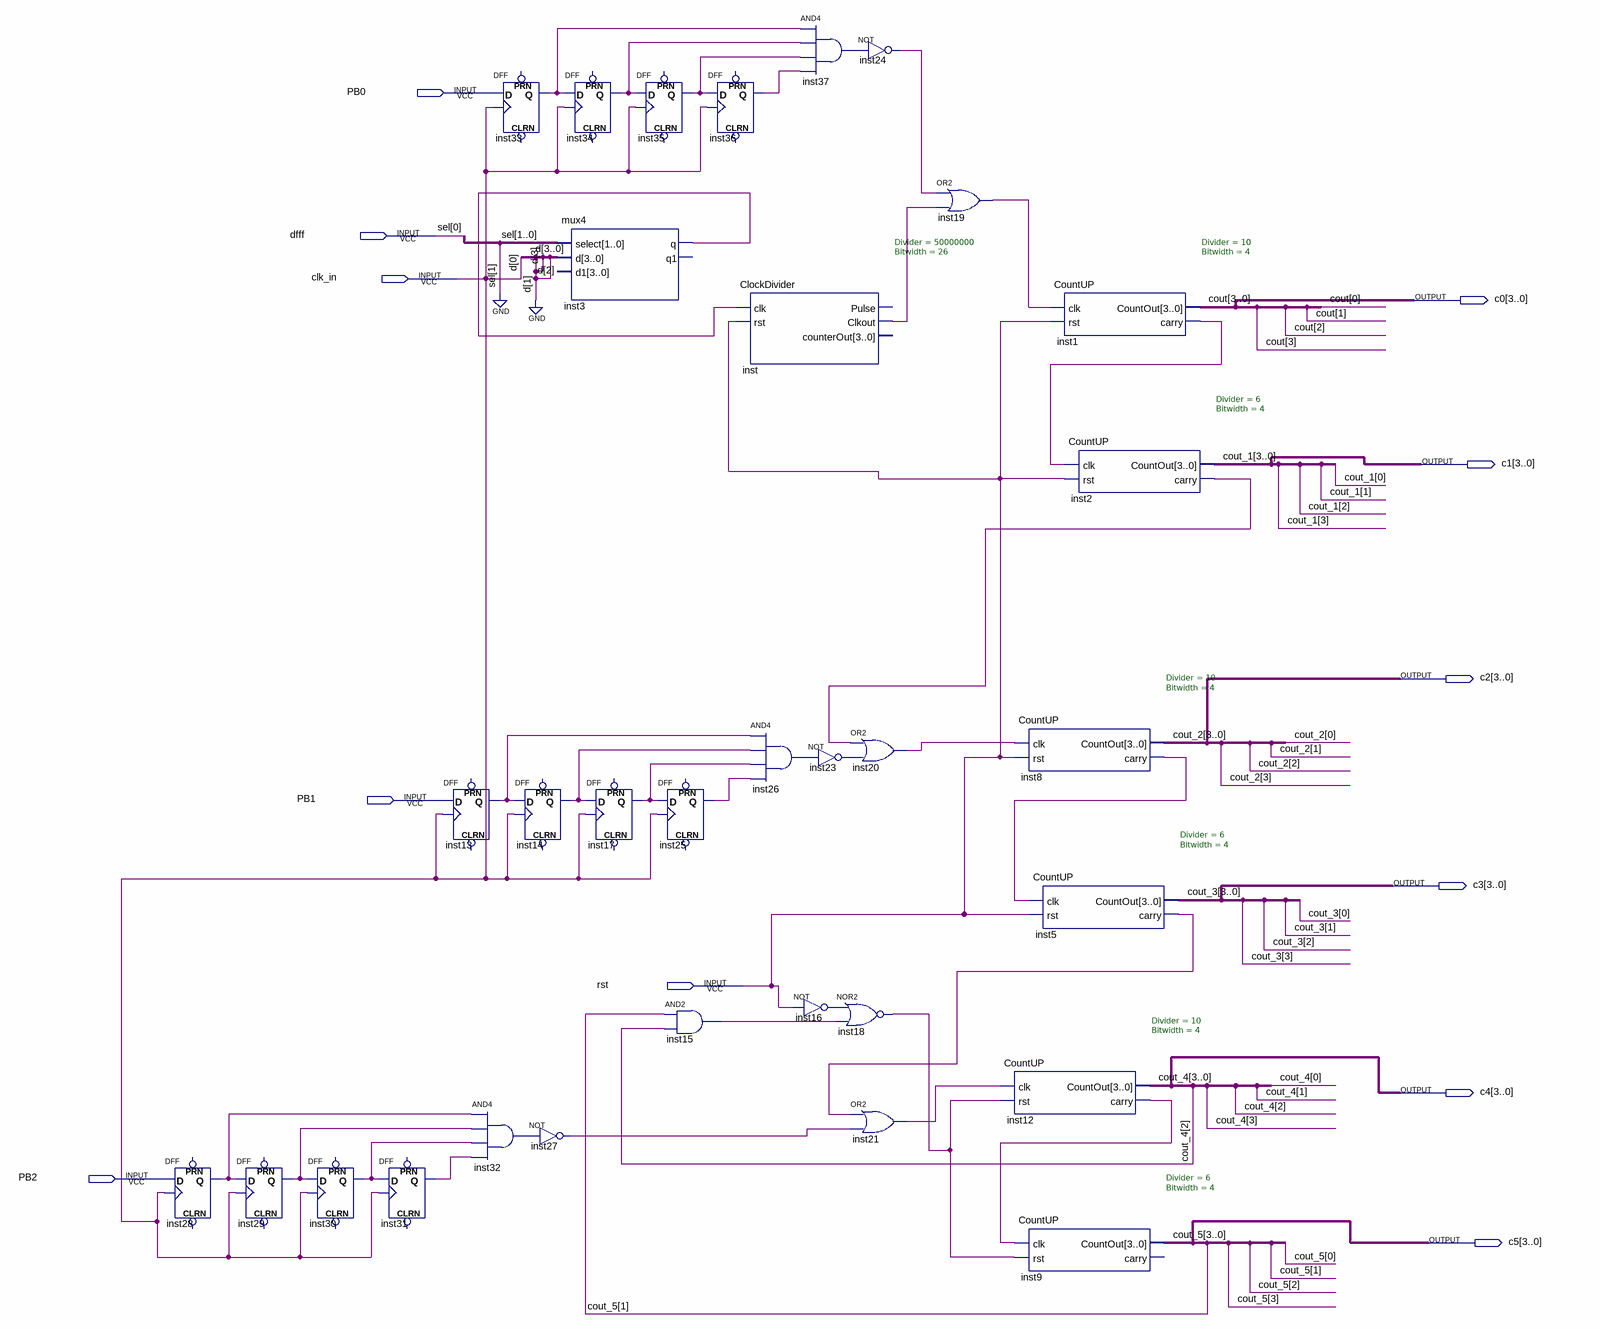
[diagram p0: schematic sheet]
// Quartus schematic ggggk.bdf as structural Verilog: 32 symbols, 12 pins
module ggggk (
  input  PB0,
  input  dfff,
  input  clk_in,
  input  PB1,
  input  rst,
  input  PB2,
  output [3:0] c0,
  output [3:0] c1,
  output [3:0] c2,
  output [3:0] c3,
  output [3:0] c4,
  output [3:0] c5
);

  wire inst1_carry, inst2_carry, inst3_q, inst5_carry, inst8_carry, inst12_carry, inst13_q, inst14_q,
       inst15_out, inst16_out, inst17_q, inst18_out, inst19_out, inst20_out, inst21_out, inst23_out,
       inst24_out, inst25_q, inst26_out, inst27_out, inst28_q, inst29_q, inst30_q, inst31_q, inst32_out,
       inst33_q, inst34_q, inst35_q, inst36_q, inst37_out, inst_clkout;

  DFF inst28 (.CLK(clk_in), .D(PB2), .Q(inst28_q));  // open: CLRN, PRN
  DFF inst29 (.CLK(clk_in), .D(inst28_q), .Q(inst29_q));  // open: CLRN, PRN
  DFF inst30 (.CLK(clk_in), .D(inst29_q), .Q(inst30_q));  // open: CLRN, PRN
  DFF inst31 (.CLK(clk_in), .D(inst30_q), .Q(inst31_q));  // open: CLRN, PRN
  DFF inst13 (.CLK(clk_in), .D(PB1), .Q(inst13_q));  // open: CLRN, PRN
  DFF inst33 (.CLK(clk_in), .D(PB0), .Q(inst33_q));  // open: CLRN, PRN
  DFF inst14 (.CLK(clk_in), .D(inst13_q), .Q(inst14_q));  // open: CLRN, PRN
  and inst32 (inst32_out, inst28_q, inst29_q, inst30_q, inst31_q);
  DFF inst34 (.CLK(clk_in), .D(inst33_q), .Q(inst34_q));  // open: CLRN, PRN
  mux4 inst3 (.select({1'b0, dfff}), .d({3'b000, clk_in}), .q(inst3_q));  // open: d1, q1
  not inst27 (inst27_out, inst32_out);
  DFF inst17 (.CLK(clk_in), .D(inst14_q), .Q(inst17_q));  // open: CLRN, PRN
  DFF inst35 (.CLK(clk_in), .D(inst34_q), .Q(inst35_q));  // open: CLRN, PRN
  DFF inst25 (.CLK(clk_in), .D(inst17_q), .Q(inst25_q));  // open: CLRN, PRN
  and inst15 (inst15_out, c5[1], c4[2]);
  DFF inst36 (.CLK(clk_in), .D(inst35_q), .Q(inst36_q));  // open: CLRN, PRN
  ClockDivider #(.Divider(50000000), .Bitwidth(26)) inst (
    .clk(inst3_q), .rst(rst), .Clkout(inst_clkout));  // open: Pulse, counterOut
  and inst37 (inst37_out, inst33_q, inst34_q, inst35_q, inst36_q);
  and inst26 (inst26_out, inst13_q, inst14_q, inst17_q, inst25_q);
  not inst16 (inst16_out, rst);
  not inst24 (inst24_out, inst37_out);
  or inst20 (inst20_out, inst2_carry, inst23_out);
  not inst23 (inst23_out, inst26_out);
  nor inst18 (inst18_out, inst16_out, inst15_out);
  or inst21 (inst21_out, inst5_carry, inst27_out);
  or inst19 (inst19_out, inst24_out, inst_clkout);
  CountUP #(.Divider(10), .Bitwidth(4)) inst8 (.clk(inst20_out), .rst(rst), .CountOut(c2), .carry(inst8_carry));
  CountUP #(.Divider(6), .Bitwidth(4)) inst5 (.clk(inst8_carry), .rst(rst), .CountOut(c3), .carry(inst5_carry));
  CountUP #(.Divider(10), .Bitwidth(4)) inst12 (
    .clk(inst21_out), .rst(inst18_out), .CountOut(c4), .carry(inst12_carry));
  CountUP #(.Divider(6), .Bitwidth(4)) inst9 (.clk(inst12_carry), .rst(inst18_out), .CountOut(c5));  // open: carry
  CountUP #(.Divider(10), .Bitwidth(4)) inst1 (.clk(inst19_out), .rst(rst), .CountOut(c0), .carry(inst1_carry));
  CountUP #(.Divider(6), .Bitwidth(4)) inst2 (.clk(inst1_carry), .rst(rst), .CountOut(c1), .carry(inst2_carry));

  // Other names for the same wires on the sheet: cout_4[3:0] = c4; cout_5[3:0] = c5; d[0] = clk_in; cout[3:0] = c0;
  //   cout_1[3:0] = c1; cout_2[3:0] = c2; cout_3[3:0] = c3; sel[0] = dfff
endmodule
